# EAGLE design shield_layer1 (EAGLE 7.3.0)
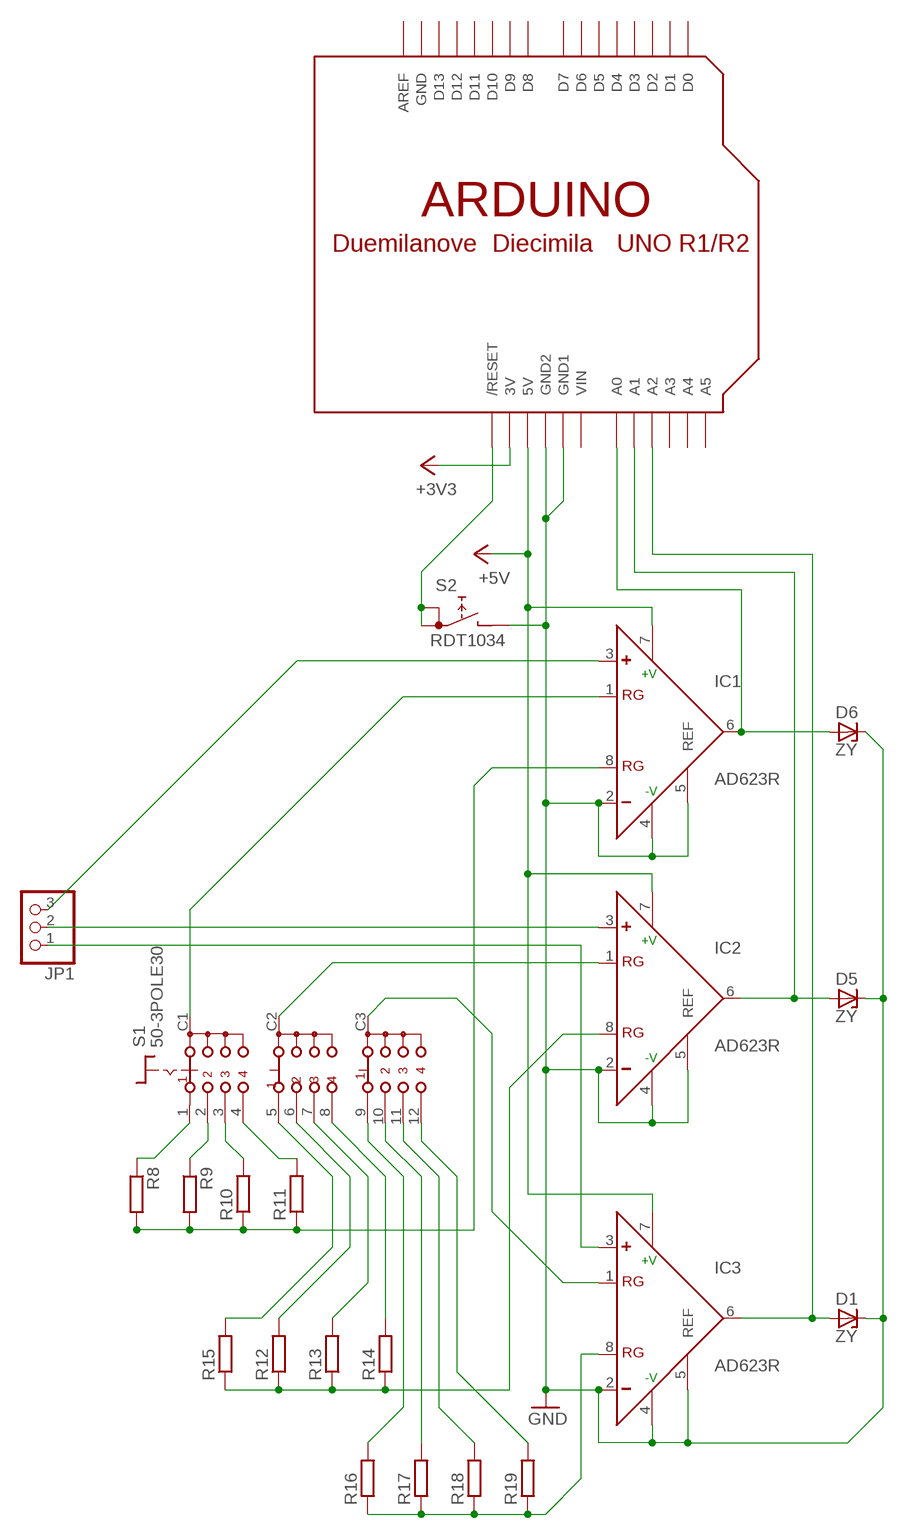
[diagram p0: schematic, sheet 1]

## Parts
D1  ZY  [P1Z12]
D5  ZY  [P1Z12]
D6  ZY  [P1Z12]
IC1  AD623R  [SO8]
IC2  AD623R  [SO8]
IC3  AD623R  [SO8]
JP1  PINHD-1X3  [1X03]
R8  R-EU_0207/10  [0207/10]
R9  R-EU_0207/10  [0207/10]
R10  R-EU_0207/10  [0207/10]
R11  R-EU_0207/10  [0207/10]
R12  R-EU_0207/10  [0207/10]
R13  R-EU_0207/10  [0207/10]
R14  R-EU_0207/10  [0207/10]
R15  R-EU_0207/10  [0207/10]
R16  R-EU_0207/10  [0207/10]
R17  R-EU_0207/10  [0207/10]
R18  R-EU_0207/10  [0207/10]
R19  R-EU_0207/10  [0207/10]
S1  50-3POLE30  [50-3POLE30]
S2  RDT1034  [RDT1034]
U$1  ARDUINOUNO  [ARDUINO]

## Nets
5V: U$1.3V ; supply symbol labelled +3V3
+5V: IC1.7(+V) IC2.7(+V) IC3.7(+V) U$1.5V
GND: D1.C D5.C D6.C IC1.2(-) IC1.4(-V) IC1.5(REF) IC2.2(-) IC2.4(-V) IC2.5(REF) IC3.2(-) IC3.4(-V) IC3.5(REF) S2.B U$1.GND1 U$1.GND2
N$4: IC1.1(RG) S1.C1(A)
N$5: IC2.1(RG) S1.C2(B)
N$7: IC2.8(RG) R12.1 R13.1 R14.1 R15.1
N$8: IC3.1(RG) S1.C3(C)
N$9: IC3.8(RG) R16.1 R17.1 R18.1 R19.1
N$10: D6.A IC1.6(OUT) U$1.A0
N$11: D5.A IC2.6(OUT) U$1.A1
N$12: D1.A IC3.6(OUT) U$1.A2
N$15: R8.1 S1.1(A1)
N$16: R9.1 S1.2(A2)
N$17: R10.2 S1.3(A3)
N$19: S2.A S2.A1 U$1.RESET(/RESET)
N$20: R11.2 S1.4(A4)
N$21: R15.2 S1.5(B1)
N$22: R12.2 S1.6(B2)
N$23: R13.2 S1.7(B3)
N$24: R14.2 S1.8(B4)
N$25: R16.2 S1.9(C1)
N$26: R17.2 S1.10(C2)
N$27: R18.2 S1.11(C3)
N$28: R19.2 S1.12(C4)
N$29: IC1.8(RG) R8.2 R9.2 R10.1 R11.1
N$38: IC1.3(+) JP1.3
N$40: IC3.3(+) JP1.1
N$42: IC2.3(+) JP1.2
Unconnected: U$1.A3 U$1.A4 U$1.A5 U$1.AREF U$1.D0 U$1.D1 U$1.D2 U$1.D3 U$1.D4 U$1.D5 U$1.D6 U$1.D7 U$1.D8 U$1.D9 U$1.D10 U$1.D11 U$1.D12 U$1.D13

## Power pins joined to a net without a drawn wire
GND: U$1.GND
VIN: U$1.VIN

## Library data of the parts
D1 D5 D6 = diode:ZY: Z DIODE
IC1-IC3 = analog-devices:AD623: Single-Supply, Rail-to-Rail, Low Cost Instrumentation Amplifier Source: http://www.analog.com/static/imported-files/data_sheets/AD623.pdf; MPN: AD623ARZ.; OC_FARNELL: 9426213; OC_NEWARK: 31M4186
JP1 = adafruit:PINHD-1X3: PIN HEADER
R8-R19 = resistor:R-EU_: RESISTOR, European symbol
S1 = switch:50-3POLE30: SERIES 50 Single-Deck Rotary Switches three pole 30° Source: www.grayhill.com .. J-15-21.pdf
S2 = switch:RDT1034: PUSH SWITCH www.radiohm.com
U$1 = adafruit:ARDUINO: Arduino Diecimila/Duemilanove Make a shield with ease, this package has all the named pins as well as the two mounting drill holes and an outline of the USB and DC power connector. The outline is on the DIMENSION layer, so if your board house uses it they will cut the outline to match. http://www.ladyada.net/library/pcb/eaglelibrary.html

## Board
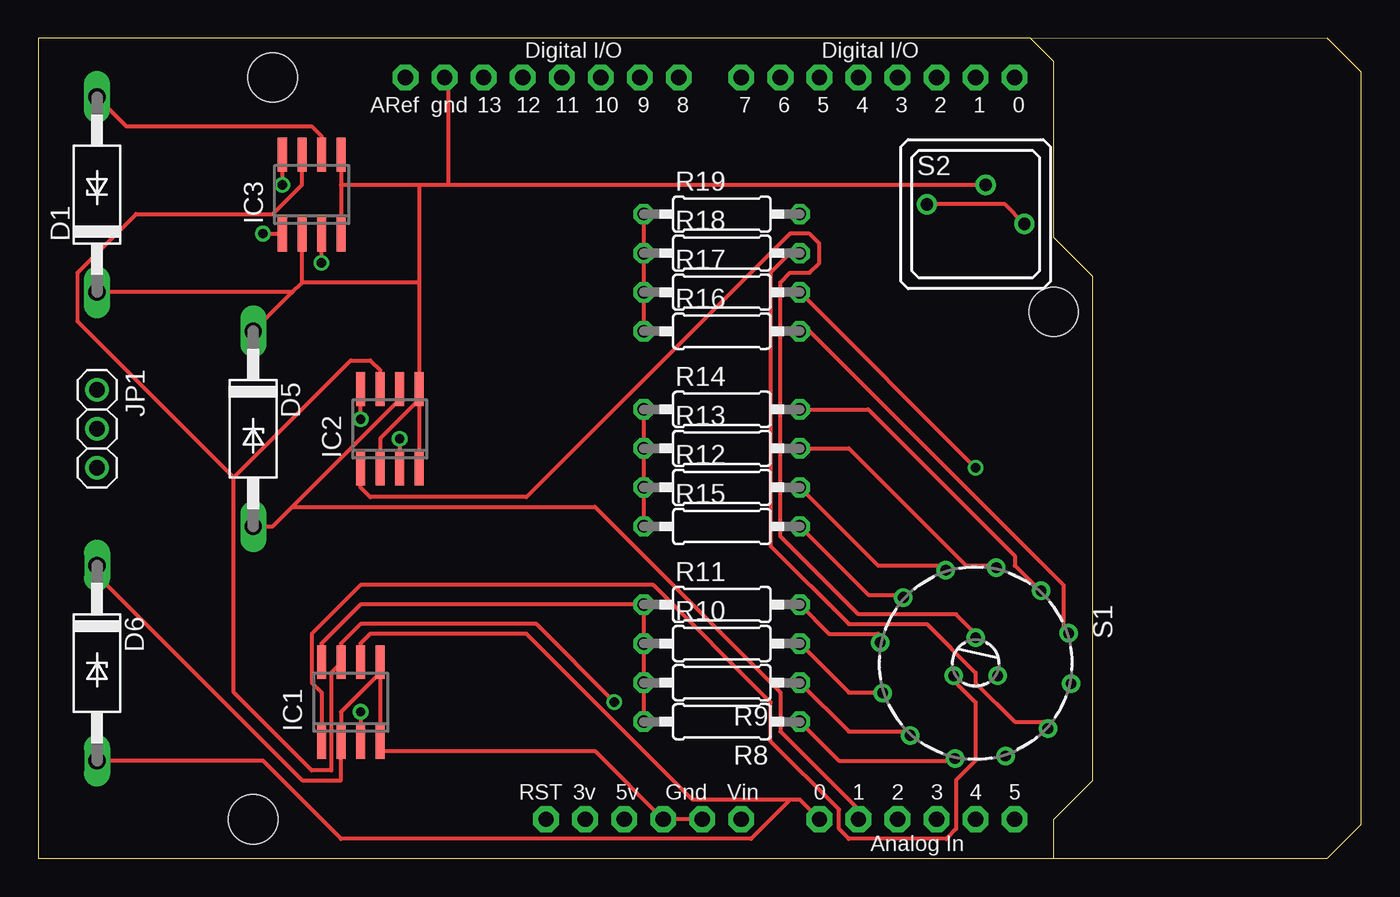
[diagram p1: board, top side]
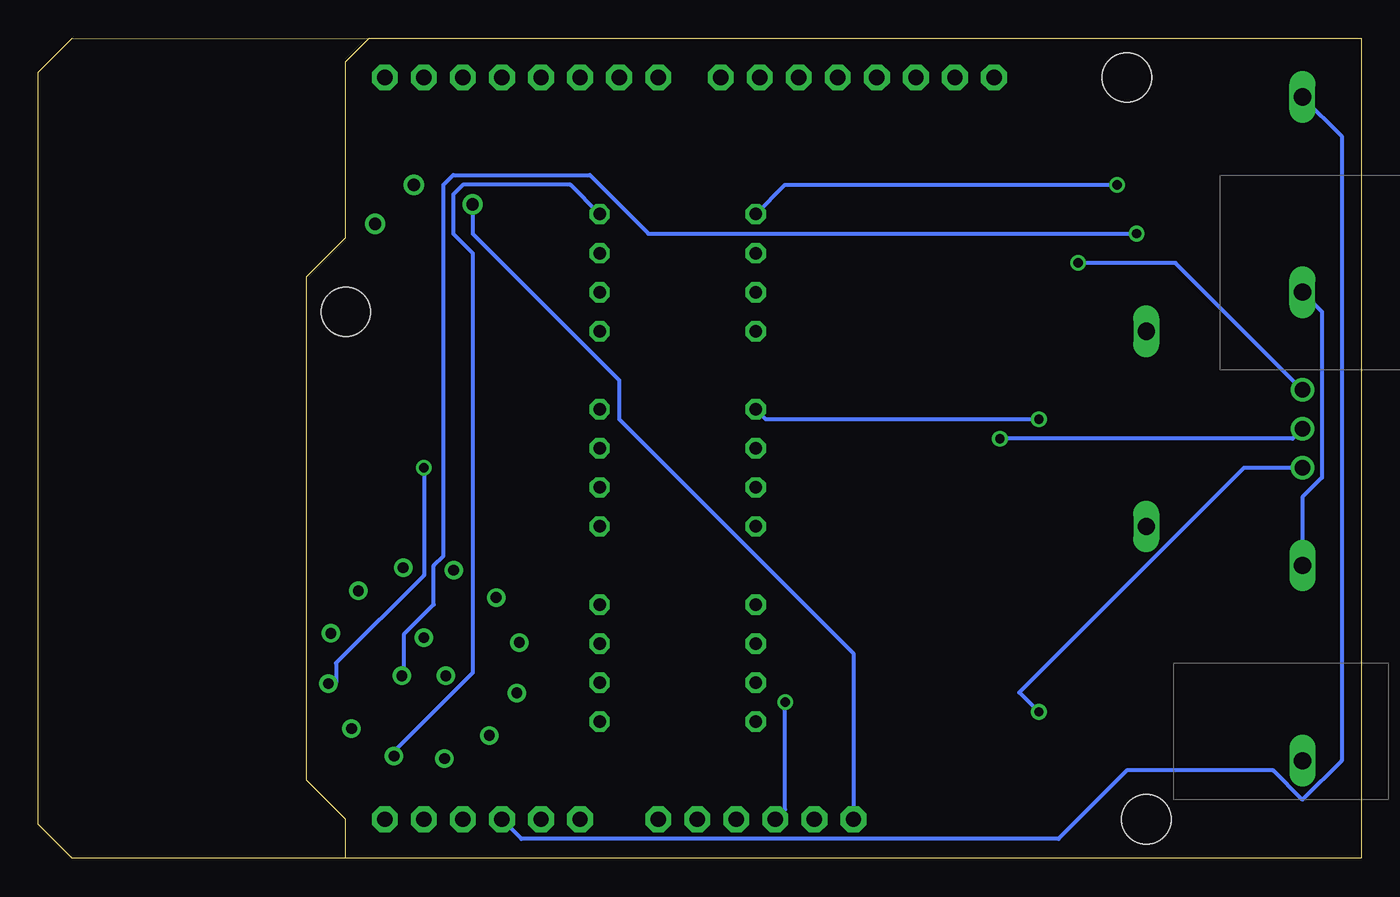
[diagram p2: board, bottom side, seen from below]

Size 86.03 x 53.34 mm. Coordinates in mm from the lower left corner, seen from the top.
Outline: 0,0 83.82,0 86.03,2.21 86.03,51.13 83.82,53.34 0,53.33 0,0
Copper layers (1*16): Top 0.035mm / dielectric 1.5mm / Bottom 0.035mm
Design rules "default": minimum track width 10mil, minimum drill 24mil, track to track 8mil, track to pad 8mil, pad to pad 8mil, via to via 8mil, smd to smd 8mil, copper to edge 40mil, drill to drill 8mil, minimum pad ring 10mil, minimum via ring 8mil, stop-mask expansion 4mil, vias tented up to drill 0mil, thermal gap 10mil

### Footprints (pad centres in the part's own frame; a part is rotated, then mirrored left to right if it is on the bottom)
P1Z12 = drill 1.118 long: A 6.35,0; C -6.35,0
SO8 = smd 0.6 x 2.2: 1 -1.905,-2.6; 2 -0.635,-2.6; 3 0.635,-2.6; 4 1.905,-2.6; 5 1.905,2.6; 6 0.635,2.6; 7 -0.635,2.6; 8 -1.905,2.6
1X03 = drill 1.016: 1 -2.54,0; 2 0,0; 3 2.54,0
0207/10 = drill 0.813 octagon: 1 -5.08,0; 2 5.08,0
50-3POLE30 = drill 0.7 pad 1.2: 1 6.207,-1.342; 2 4.704,-4.265; 3 1.941,-6.046; 4 -1.342,-6.207; 5 -4.265,-4.704; 6 -6.046,-1.941; 7 -6.207,1.342; 8 -4.704,4.265; 9 -1.941,6.046; 10 1.342,6.207; 11 4.265,4.704; 12 6.046,1.941; C1 0.825,-1.429; C2 -1.65,0; C3 0.825,1.429
RDT1034 = drill 0.8: A 3.175,-0.635; A1 -3.175,0.635; B 0.65,1.9
ARDUINO = drill 1 pad 1.676 octagon: 3V 35.56,2.54; 5V 38.1,2.54; A0 50.8,2.54; A1 53.34,2.54; A2 55.88,2.54; A3 58.42,2.54; A4 60.96,2.54; A5 63.5,2.54; AREF 23.876,50.8; D0 63.5,50.8; D1 60.96,50.8; D2 58.42,50.8; D3 55.88,50.8; D4 53.34,50.8; D5 50.8,50.8; D6 48.26,50.8; D7 45.72,50.8; D8 41.656,50.8; D9 39.116,50.8; D10 36.576,50.8; D11 34.036,50.8; D12 31.496,50.8; D13 28.956,50.8; GND 26.416,50.8; GND1 43.18,2.54; GND2 40.64,2.54; RESET 33.02,2.54; VIN 45.72,2.54 | hole 3.2: 15.24,50.8; 66.04,35.56; 13.97,2.54

### Placement (x,y rotation side)
D1  3.81,43.18 90 top
D5  13.97,27.94 270 top
D6  3.81,12.7 270 top
IC1  20.32,10.16 0 top
IC2  22.86,27.94 0 top
IC3  17.78,43.18 0 top
JP1  3.81,27.94 270 top
R8  44.45,8.89 180 top
R9  44.45,11.43 180 top
R10  44.45,13.97 0 top
R11  44.45,16.51 0 top
R12  44.45,24.13 0 top
R13  44.45,26.67 0 top
R14  44.45,29.21 0 top
R15  44.45,21.59 0 top
R16  44.45,34.29 0 top
R17  44.45,36.83 0 top
R18  44.45,39.37 0 top
R19  44.45,41.91 0 top
S1  60.96,12.7 270 top
S2  60.96,41.91 0 top
U$1  0,0 0 top

### Tracks (layer width: path | path; a pad name or v marks a point on that pad's centre or on a via)
+5V  (via drill 0.61)
  Top 0.254: v37.47,10.16 32.38,15.24 20.95,15.24 19.68,13.97 IC1.7 19.68,12.7 19.05,12.06 19.05,5.71 17.78,5.71 12.7,10.79 12.7,24.77 | IC2.7 22.23,31.75 21.59,32.38 20.32,32.38 12.7,24.77 | IC3.7 17.14,43.81 15.24,41.91 6.35,41.91 2.54,38.1 2.54,34.92 12.7,24.77
  Bottom 0.254: v37.47,10.16 37.47,3.17 U$1.5V
GND
  Top 0.254: U$1.GND1 U$1.GND2 36.2,6.99 22.23,6.99 IC1.4 22.23,12.06 | 22.23,12.06 19.68,9.53 IC1.2 19.68,5.08 17.14,5.08 3.81,18.41 D6.C | IC1.5 22.23,12.06 | 17.14,37.47 IC3.2 | D5.C 16.51,36.83 | 16.51,36.83 17.14,37.47 | IC2.2 22.23,27.3 24.77,29.84 | 24.77,29.84 IC2.5 24.77,37.47 | 24.77,29.84 IC2.4 | IC3.5 19.68,43.81 | 19.68,43.81 IC3.4 | 19.68,43.81 24.77,43.81 | 24.77,43.81 26.67,43.81 | 26.67,43.81 61.59,43.81 S2.B | 26.67,43.81 26.67,50.8 U$1.GND | 24.77,43.81 24.77,37.47 | 24.77,37.47 17.14,37.47 | 16.51,36.83 D1.C
  Bottom 0.254: D6.C 3.81,23.5 2.54,24.77 2.54,35.56 D1.C
N$4
  Top 0.254: IC1.1 18.41,10.79 17.78,11.43 17.78,14.61 20.95,17.78 40.01,17.78 47.62,10.16 47.62,7.62 52.07,3.17 52.07,1.91 52.7,1.27 59.05,1.27 59.69,1.91 59.69,5.08 60.96,6.35 60.96,10.16 59.69,11.43 S1.C1
N$5
  Top 0.254: IC2.1 20.95,24.13 21.59,23.5 31.75,23.5 48.9,40.64 50.16,40.64 50.8,40.01 50.8,38.73 50.16,38.1 48.9,38.1 48.26,37.47 48.26,20.95 53.34,15.88 59.69,15.88 60.96,14.61 S1.C2
N$7  (via drill 0.61)
  Top 0.254: R15.1 R12.1 R13.1 R14.1 | v20.95,28.57 IC2.8
  Bottom 0.254: v20.95,28.57 38.73,28.57 R14.1
N$8  (via drill 0.61)
  Top 0.254: v14.61,40.64 15.88,40.64 IC3.1
  Bottom 0.254: v14.61,40.64 46.35,40.64 50.16,44.45 59.05,44.45 59.69,43.81 59.69,19.68 60.33,19.05 60.33,16.51 62.23,14.61 62.23,12.06 S1.C3
N$9  (via drill 0.61)
  Top 0.254: R16.1 R17.1 R18.1 R19.1 | v15.88,43.81 IC3.8
  Bottom 0.254: v15.88,43.81 37.47,43.81 R19.1
N$10
  Top 0.254: IC1.6 20.95,13.97 21.59,14.61 31.75,14.61 42.55,3.81 48.9,3.81 | 48.9,3.81 49.53,3.81 U$1.A0 | D6.A 14.61,6.35 19.68,1.27 46.35,1.27 48.9,3.81
N$11
  Top 0.254: IC2.6 23.5,29.84 16.51,22.86 | 16.51,22.86 15.24,21.59 D5.A | U$1.A1 53.34,3.17 48.26,8.26 48.26,10.79 36.2,22.86 16.51,22.86
N$12
  Top 0.254: IC3.6 18.41,46.99 17.78,47.62 5.71,47.62 D1.A
  Bottom 0.254: U$1.A2 54.61,1.27 19.68,1.27 15.24,5.71 5.71,5.71 3.81,3.81 1.27,6.35 1.27,46.99 D1.A
N$15
  Top 0.254: R8.1 52.07,6.35 59.05,6.35 S1.1
N$16
  Top 0.254: R9.1 52.7,8.26 56.52,8.26 S1.2
N$17
  Top 0.254: R10.2 52.7,10.79 54.61,10.79 S1.3
N$19
  Top 0.254: S2.A1 62.87,42.55 S2.A
  Bottom 0.254: U$1.RESET 33.02,13.34 48.26,28.57 48.26,31.11 57.78,40.64 S2.A1
N$20
  Top 0.254: R11.2 51.44,14.61 54.61,14.61 S1.4
N$21
  Top 0.254: R15.2 53.98,17.14 55.88,17.14 S1.5
N$22
  Top 0.254: R12.2 54.61,19.05 59.05,19.05 S1.6
N$23
  Top 0.254: R13.2 52.7,26.67 60.33,19.05 62.23,19.05 S1.7
N$24
  Top 0.254: R14.2 53.98,29.21 63.5,19.68 63.5,19.05 64.77,17.78 S1.8
N$25
  Top 0.254: R16.2 50.16,34.29 66.67,17.78 66.67,14.61 S1.9
N$26  (via drill 0.61)
  Top 0.254: R17.2 v60.96,25.4
  Bottom 0.254: v60.96,25.4 60.96,18.41 66.67,12.7 66.67,11.43 S1.10
N$27
  Top 0.254: R18.2 48.9,39.37 47.62,38.1 47.62,20.32 52.7,15.24 57.78,15.24 60.96,12.06 60.96,11.43 63.5,8.89 65.41,8.89 S1.11
N$28
  Bottom 0.254: R19.2 51.44,43.81 58.42,43.81 59.05,43.18 59.05,40.64 57.78,39.37 57.78,12.06 62.87,6.99 S1.12
N$29
  Top 0.254: R8.2 R9.2 R10.1 R11.1 20.95,16.51 18.41,13.97 IC1.8
N$38  (via drill 0.61)
  Top 0.254: v20.95,9.53 IC1.3
  Bottom 0.254: v20.95,9.53 22.23,10.79 7.62,25.4 JP1.3
N$40  (via drill 0.61)
  Top 0.254: v18.41,38.73 IC3.3
  Bottom 0.254: v18.41,38.73 12.06,38.73 JP1.1
N$42  (via drill 0.61)
  Top 0.254: v23.5,27.3 IC2.3
  Bottom 0.254: v23.5,27.3 4.45,27.3 JP1.2